# Altium project PWM_555.PrjPcb
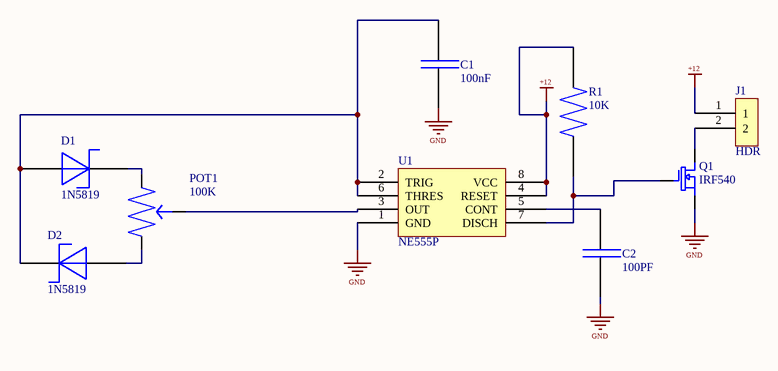
[diagram p0: Sheet2.SchDoc]
1 sheet, 9 parts. Net scope: global (net labels, ports and power ports of the same name join across sheets).
Board file: PCB1.PcbDoc

## Sheet Sheet2.SchDoc
size A4; Organization: Altium Limited; Address1: L3, 12a Rodborough Rd; Address2: Frenchs Forest; Address3: NSW; Address4: Australia 2086

### Parts
C1  100nF  [CAP]
C2  100PF  [CAP]
D1  1N5819  [DIODE1N5819]
D2  1N5819  [DIODE1N5819]
J1  HDR  [HDR1X2]
POT1  100K  [POT]
Q1  IRF540  [TO-220]
R1  10K  [TH_L6.8]
U1  NE555P  [DIP8]

### Nets
+12: J1.1 R1.1 U1.4(RESET) U1.8(VCC)
GND: C1.1 C2.1 Q1.3 U1.1(GND)
NetC1_2: C1.2 D1.1 D2.2 U1.2(TRIG) U1.6(THRES)
NetC2_2: C2.2 U1.5(CONT)
NetD1_2: D1.2 POT1.1
NetD2_1: D2.1 POT1.2
NetJ1_2: J1.2 Q1.2
NetPOT1_3: POT1.3 U1.3(OUT)
NetQ1_1: Q1.1 R1.2 U1.7(DISCH)

### Notes on the sheet
- Title
- Size:
- Date:
- A4
- Number:
- Time:
- Revision:
- Sheet
- of
- File:

### Library data of the parts
C1 = RCER71E104K0K1H03B: Cap Ceramic Monolithic 0.1uF 25VDC 10% Thru-Hole Bulk; Manufacturer: Murata; Supplier 1: Mouser; Manufacturer Part Number: RCER71E104K0K1H03B; Stock 1: 894; ComponentLink1URL: http://datasheet.octopart.com/RCER71E104K0K1H03B-Murata-datasheet-138760971.pdf?src-supplier=Ciiva+Crawler; ComponentLink1Description: http://datasheet.octopart.com/RCER71E104K0K1H03B-Murata-datasheet-138760971.pdf?src-supplier=Ciiva+Crawler; ComponentLink2URL: http://datasheet.octopart.com/RCER71E104K0K1H03B-Murata-datasheet-140720004.pdf?src-supplier=Ciiva+Crawler; ComponentLink2Description: http://datasheet.octopart.com/RCER71E104K0K1H03B-Murata-datasheet-140720004.pdf?src-supplier=Ciiva+Crawler; Supplier Part Number 1: 81-RCER71E104K0K1H3B; Pricing 1: 1=0.32000, 10=0.15600, 100=0.11100, 500=0.10000, 1000=0.08500, 2500=0.07700 (USD)
C2 = C315C101F3G5TA: Manufacturer: KEMET; Supplier 1: Mouser; Manufacturer Part Number: C315C101F3G5TA; RoHS: No; Stock 1: 415; Supplier Part Number 1: 80-C315C101F3G5TA; Pricing 1: 1=1.10000, 10=0.88000, 50=0.76000, 100=0.66000, 250=0.58000, 500=0.48100 (USD)
D1 D2 = 1N5819: 1N58 Series 600 mV 1 A 40 V Max Reverse Voltage Schottky Barrier Rectifier-DO-41; Manufacturer: ON Semiconductor / Fairchild; Element Configuration: Single; Peak Non-Repetitive Surge Current: 25A; Forward Voltage: 900mV; Forward Current: 1A; Max Repetitive Reverse Voltage (Vrrm): 40V; Peak Reverse Current: 500uA; Polarity: Standard; Max Reverse Leakage Current: 1mA; Capacitance: 110pF; Supplier 1: Mouser; Manufacturer Part Number: 1N5819; RoHS: Yes; Category: Schottky Diodes; Stock 1: 7162; Mount: Through Hole; Number of Pins: 2; Weight: 0.245g; Contact Plating: Tin,Matte; Min Operating Temperature: -65°C; Max Operating Temperature: 125°C; Packaging: Tape and Reel; Package Quantity: 5000; Average Rectified Current: 1A; Max Reverse Voltage (DC): 40V; Max Forward Surge Current (Ifsm): 25A; Current Rating: 1A; Voltage Rating (DC): 40V; Output Current: 1A; Max Surge Current: 25A; Diameter: 2.72mm; Length: 5.2mm; Height: 2.7mm; Width: 2.7mm; Radiation Hardening: No; Lead Free: Lead Free; REACH SVHC: No SVHC; ComponentLink1URL: https://datasheet.ciiva.com/4719/1n5817-d-103200-4719059.pdf?src-supplier=Mouser; ComponentLink1Description: https://datasheet.ciiva.com/4719/1n5817-d-103200-4719059.pdf?src-supplier=Mouser; ComponentLink2URL: https://datasheet.ciiva.com/34302/1200637-34302074.pdf?src-supplier=Jameco; ComponentLink2Description: https://datasheet.ciiva.com/34302/1200637-34302074.pdf?src-supplier=Jameco; ComponentLink3URL: https://datasheet.ciiva.com/22651/1671052-22651942.pdf?src-supplier=Element14; ComponentLink3Description: https://datasheet.ciiva.com/22651/1671052-22651942.pdf?src-supplier=Element14; ComponentLink4URL: https://datasheet.ciiva.com/25951/1n5819-25951350.pdf?src-supplier=Avnet+Europe; ComponentLink4Description: https://datasheet.ciiva.com/25951/1n5819-25951350.pdf?src-supplier=Avnet+Europe; ComponentLink5URL: https://datasheet.ciiva.com/8300/1n5819-8300426.pdf?src-supplier=Avnet; ComponentLink5Description: https://datasheet.ciiva.com/8300/1n5819-8300426.pdf?src-supplier=Avnet; ComponentLink6URL: https://datasheet.ciiva.com/1177/1671052-1177084.pdf?src-supplier=Element14; ComponentLink6Description: https://datasheet.ciiva.com/1177/1671052-1177084.pdf?src-supplier=Element14; Supplier Part Number 1: 512-1N5819; Pricing 1: 1=0.39000, 10=0.26400, 100=0.12300, 1000=0.09600, 5000=0.08300, 10000=0.07400 (USD)
J1 = HDR1X2
POT1 = PDB12-M4251-104BF: Potentiometers 100K LINEAR 12MM; Manufacturer: Bourns; Max Power Dissipation: 80mW; Resistance: 100kR; Tolerance: 20%; Number of Gangs: 1; Actuator Length: 0.984inch; Actuator Diameter: 0.236inch; Supplier 1: Mouser; Manufacturer Part Number: PDB12-M4251-104BF; RoHS: Yes; Category: Variable Resistors and Potentiometers; Stock 1: 220; Mount: Through Hole,Brackets; Min Operating Temperature: -10°C; Max Operating Temperature: 50°C; Power Rating: 80mW; Package Quantity: 100; Packaging: Bulk; Type: Potentiometer; Taper: Linear; Number of Turns: 1; Termination: Pin; Composition: Carbon; Military Standard: Not; Length: 12.8mm; Depth: 12.8mm; Radiation Hardening: No; ComponentLink1URL: https://datasheet.ciiva.com/6249/pdb12-6249595.pdf?src-supplier=Digi-Key; ComponentLink1Description: https://datasheet.ciiva.com/6249/pdb12-6249595.pdf?src-supplier=Digi-Key; Supplier Part Number 1: 652-PDB12-M4251104BF; Pricing 1: 1=1.01000, 10=0.77000, 100=0.70000, 500=0.59000, 1000=0.55000, 2500=0.48000 (USD)
Q1 = IRF540: MOSFET N-CH 100V 28A TO-220AB; Manufacturer: Vishay Siliconix; Power Dissipation: 150W; Gate to Source Voltage (Vgs): 20V; Rds On Max: 77mR; Input Capacitance: 1.7nF; Number of Elements: 1; Rise Time: 44ns; Turn-Off Delay Time: 53ns; Fall Time: 43ns; Element Configuration: Single; Turn-On Delay Time: 11ns; Supplier 1: Mouser; Manufacturer Part Number: IRF540; RoHS: Yes; Category: MOSFETs; Mount: Through Hole; Case/Package: TO-220-3; Number of Pins: 3; Weight: 0.211644oz; Min Operating Temperature: -55°C; Max Operating Temperature: 175°C; Continuous Drain Current (ID): 28A; Packaging: Rail/Tube; Drain to Source Voltage (Vdss): 100V; Max Power Dissipation: 150W; Drain to Source Breakdown Voltage: 100V; Drain to Source Resistance: 77mR; Package Quantity: 1000; Voltage Rating (DC): 100V; Current Rating: 28A; Number of Channels: 1; Current: 28A; Voltage: 100V; Length: 10.51mm; Height: 9.01mm; Width: 4.7mm; Lead Free: Contains Lead; ComponentLink1URL: https://datasheet.ciiva.com/8114/91021-8114330.pdf?src-supplier=Avnet; ComponentLink1Description: https://datasheet.ciiva.com/8114/91021-8114330.pdf?src-supplier=Avnet; Supplier Part Number 1: 844-IRF540
R1 = CFR-25SJT-52-10K: Res Carbon Film 10K Ohm 5% 0.25W(1/4W) -500ppm/C to 350ppm/C Conformal Coated AXL Ammo Pack; Manufacturer: Yageo; Resistance: 10kR; Temperature Coefficient: 350ppm/°C; Supplier 1: Mouser; Manufacturer Part Number: CFR-25SJT-52-10K; RoHS: Yes; Category: Through-Hole Resistors; Stock 1: 2722; Mount: Through Hole; Case/Package: Conformal; Contact Plating: Tin,Matte; Min Operating Temperature: -55°C; Max Operating Temperature: 155°C; Tolerance: 5%; Composition: Carbon Film; Termination: Axial; Military Standard: Not; Packaging: Ammo Pack; Diameter: 2.4mm; Length: 6.3mm; Radiation Hardening: No; ComponentLink1URL: http://components.arrow.com/part/dataview/0323_00776785?src-supplier=Arrow+Europe; ComponentLink1Description: http://components.arrow.com/part/dataview/0323_00776785?src-supplier=Arrow+Europe; ComponentLink2URL: http://www.yageo.com/documents/recent/Leaded-R_CFR_2011.pdf?src-supplier=Avnet+Europe; ComponentLink2Description: http://www.yageo.com/documents/recent/Leaded-R_CFR_2011.pdf?src-supplier=Avnet+Europe; ComponentLink3URL: http://www.yageo.com/documents/recent/Yageo%20LR_CFR_2013.pdf?src-supplier=Avnet; ComponentLink3Description: http://www.yageo.com/documents/recent/Yageo%20LR_CFR_2013.pdf?src-supplier=Avnet; ComponentLink4URL: http://www.yageo.com/documents/recent/Leaded-R_CFR_2011.pdf?src-supplier=Avnet; ComponentLink4Description: http://www.yageo.com/documents/recent/Leaded-R_CFR_2011.pdf?src-supplier=Avnet; Supplier Part Number 1: 603-CFR25SJT-52-10K; Pricing 1: 1=0.10000, 10=0.04300, 100=0.01500, 1000=0.01100, 5000=0.00800, 10000=0.00700 (USD)
U1 = NE555P: Standard Timer Single 8-Pin PDIP Tube; Manufacturer: Texas Instruments; Frequency: 500kHz; Quiescent Current: 15mA; Operating Supply Current: 10mA; Min Supply Voltage: 4.5V; Max Supply Voltage: 16V; Nominal Supply Current: 2mA; Number of Timers/Counters: 1; High Level Output Current: -200mA; Low Level Output Current: 200mA; Operating Supply Voltage: 5V; Supplier 1: Digi-Key; Manufacturer Part Number: NE555P; RoHS: Yes; Category: Clock and Timing; Stock 1: 20716; Mount: Through Hole; Case/Package: PDIP; Number of Pins: 8; Weight: 0.015535oz; Contact Plating: Gold; Min Operating Temperature: 0°C; Max Operating Temperature: 70°C; Packaging: Rail/Tube; Package Quantity: 50; Current Rating: 10mA; Length: 9.81mm; Height: 4.57mm; Width: 6.35mm; Radiation Hardening: No; Lead Free: Lead Free; REACH SVHC: No SVHC; ComponentLink1URL: https://datasheet.ciiva.com/1139/sa555-1139904.pdf?src-supplier=Element14; ComponentLink1Description: https://datasheet.ciiva.com/1139/sa555-1139904.pdf?src-supplier=Element14; ComponentLink2URL: https://datasheet.ciiva.com/19457/904085-19457361.pdf?src-supplier=Jameco; ComponentLink2Description: https://datasheet.ciiva.com/19457/904085-19457361.pdf?src-supplier=Jameco; ComponentLink3URL: https://datasheet.ciiva.com/26325/152184-da-01-en-ne555p-timer-tid-26325915.pdf?src-supplier=Conrad; ComponentLink3Description: https://datasheet.ciiva.com/26325/152184-da-01-en-ne555p-timer-tid-26325915.pdf?src-supplier=Conrad; ComponentLink4URL: https://datasheet.ciiva.com/1147/1764032-1147750.pdf?src-supplier=Newark; ComponentLink4Description: https://datasheet.ciiva.com/1147/1764032-1147750.pdf?src-supplier=Newark; ComponentLink5URL: https://datasheet.ciiva.com/14094/ne555-series-eng-tds-14094950.pdf?src-supplier=Distrelec; ComponentLink5Description: https://datasheet.ciiva.com/14094/ne555-series-eng-tds-14094950.pdf?src-supplier=Distrelec; ComponentLink6URL: https://datasheet.ciiva.com/14274/ne555-14274456.pdf?src-supplier=Avnet; ComponentLink6Description: https://datasheet.ciiva.com/14274/ne555-14274456.pdf?src-supplier=Avnet; ComponentLink7URL: https://datasheet.ciiva.com/15152/getdatasheetpartid-248510-15152620.pdf?src-supplier=Verical; ComponentLink7Description: https://datasheet.ciiva.com/15152/getdatasheetpartid-248510-15152620.pdf?src-supplier=Verical; ComponentLink8URL: https://datasheet.ciiva.com/26228/ne555-26228892.pdf?src-supplier=Avnet+Europe; ComponentLink8Description: https://datasheet.ciiva.com/26228/ne555-26228892.pdf?src-supplier=Avnet+Europe; ComponentLink9URL: https://datasheet.ciiva.com/1233/ne555-1233454.pdf?src-supplier=Digi-Key; ComponentLink9Description: https://datasheet.ciiva.com/1233/ne555-1233454.pdf?src-supplier=Digi-Key; Supplier Part Number 1: 296-NE555P-ND; Pricing 1: 1=0.45000, 10=0.34200, 25=0.30800, 100=0.21280, 250=0.17920, 500=0.14560, 1000=0.11200, 2500=0.10080, 5000=0.09520 (USD)